# Altium schematic sheet TYPE_CO-USB3.0.SchDoc
size B
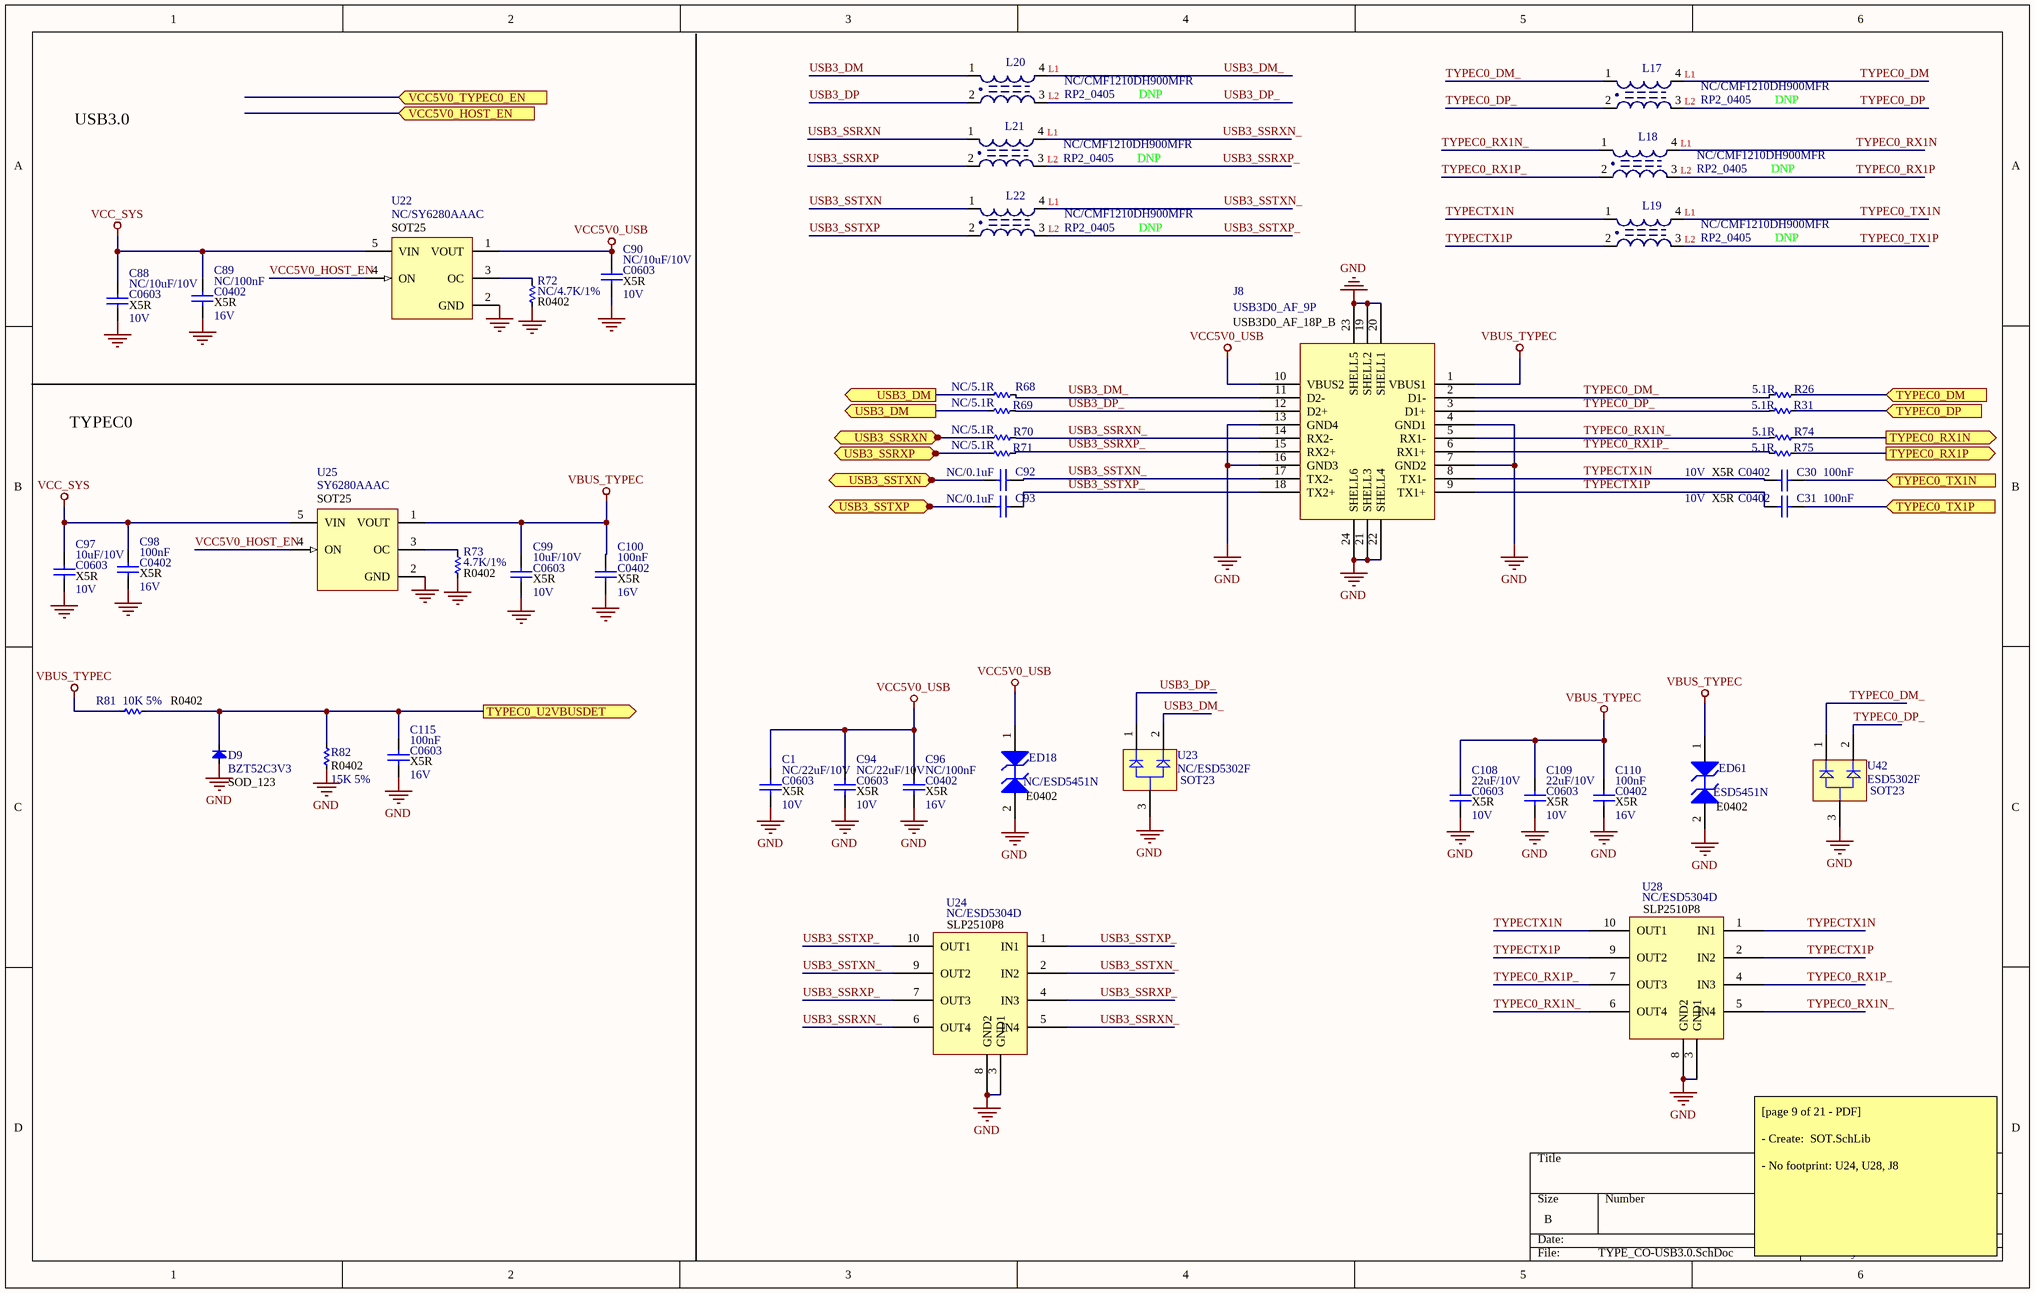
[diagram p0: TYPE_CO-USB3.0.SchDoc]

## Parts
C1  C0603  value NC/22uF/10V  [C 0603]
C30  C0402  value 100nF  [C 0402]
C31  C0402  value 100nF  [C 0402]
C88  C0603  value NC/10uF/10V  [C 0603]
C89  C0402  value NC/100nF  [C 0402]
C90  C0603  value NC/10uF/10V  [C 0603]
C92  value NC/0.1uF  [C 0402]  (hidden comment: C0402)
C93  value NC/0.1uF  [C 0402]  (hidden comment: C0402)
C94  C0603  value NC/22uF/10V  [C 0603]
C96  C0402  value NC/100nF  [C 0402]
C97  C0603  value 10uF/10V  [C 0603]
C98  C0402  value 100nF  [C 0402]
C99  C0603  value 10uF/10V  [C 0603]
C100  C0402  value 100nF  [C 0402]
C108  C0603  value 22uF/10V  [C 0603]
C109  C0603  value 22uF/10V  [C 0603]
C110  C0402  value 100nF  [C 0402]
C115  C0603  value 100nF  [C 0603]
D9  value BZT52C3V3  typr: SOD_123  [DIO-SMD-123]  (hidden comment: Diode SMD)
ED18  NC/ESD5451N  [DFN1006-2L]
ED61  ESD5451N  [DFN1006-2L]
J8  USB3D0_AF_9P  [*GCT_USB1100-XX-X_REVC]
L17  RP2_0405  [L-SMD-D-7.3x7.3]
L18  RP2_0405  [L-SMD-D-7.3x7.3]
L19  RP2_0405  [L-SMD-D-7.3x7.3]
L20  RP2_0405  [L-SMD-D-7.3x7.3]
L21  RP2_0405  [L-SMD-D-7.3x7.3]
L22  RP2_0405  [L-SMD-D-7.3x7.3]
R26  value 5.1R  [R 0402]  (hidden comment: R0402)
R31  value 5.1R  [R 0402]  (hidden comment: R0402)
R68  value NC/5.1R  [R 0402]  (hidden comment: R0402)
R69  value NC/5.1R  [R 0402]  (hidden comment: R0402)
R70  value NC/5.1R  [R 0402]  (hidden comment: R0402)
R71  value NC/5.1R  [R 0402]  (hidden comment: R0402)
R72  R0402  value NC/4.7K/1%  [R 0402]
R73  R0402  value 4.7K/1%  [R 0402]
R74  value 5.1R  [R 0402]  (hidden comment: R0402)
R75  value 5.1R  [R 0402]  (hidden comment: R0402)
R81  R0402  value 10K 5%  [R 0402]
R82  R0402  value 15K 5%  [R 0402]
U22  NC/SY6280AAAC  [DCK5_N]
U23  NC/ESD5302F  PackageReference: SOT23  [INF-SOT23_N]
U24  NC/ESD5304D  [RCLAMP0524PATCT]
U25  SY6280AAAC  [DCK5_N]
U28  NC/ESD5304D  [RCLAMP0524PATCT]
U42  ESD5302F  PackageReference: SOT23  [INF-SOT23_N]

## Ports
TYPEC0_DM (in), TYPEC0_DP (in), TYPEC0_RX1N (out), TYPEC0_RX1P (out), TYPEC0_TX1N (in), TYPEC0_TX1P (in), TYPEC0_U2VBUSDET (out), USB3_DM (out), USB3_SSRXN (out), USB3_SSRXP (out), USB3_SSTXN (out), USB3_SSTXP (out), VCC5V0_HOST_EN (in), VCC5V0_TYPEC0_EN (in)

## Nets
GND: C1.2 C88.2 C89.2 C90.2 C94.2 C96.2 C97.2 C98.2 C99.2 C100.2 C108.2 C109.2 C110.2 C115.2 D9.1(A) ED18.2(A2) ED61.2(A2) J8.4(GND1) J8.7(GND2) J8.13(GND4) J8.16(GND3) J8.19(SHELL2) J8.20(SHELL1) J8.21(SHELL3) J8.22(SHELL4) J8.23(SHELL5) J8.24(SHELL6) R72.2 R73.2 R82.1 U22.2(GND) U23.3(A) U24.3(GND1) U24.8(GND2) U25.2(GND) U28.3(GND1) U28.8(GND2) U42.3(A)
VBUS_TYPEC: C99.1 C100.1 C108.1 C109.1 C110.1 ED61.1(A1) J8.1(VBUS1) R81.1 U25.1(VOUT)
VCC5V0_USB: C1.1 C90.1 C94.1 C96.1 ED18.1(A1) J8.10(VBUS2) U22.1(VOUT)
VCC_SYS: C88.1 C89.1 C97.1 C98.1 U22.5(VIN) U25.5(VIN)
TYPEC0_DM: L17.4
TYPEC0_DM: R26.1 ; port TYPEC0_DM  [a separate net that carries the same name]
TYPEC0_DM_: J8.2(D1-) L17.1 R26.2 U42.1(K1)
TYPEC0_DP: L17.3
TYPEC0_DP: R31.1 ; port TYPEC0_DP  [a separate net that carries the same name]
TYPEC0_DP_: J8.3(D1+) L17.2 R31.2 U42.2(K2)
TYPEC0_RX1N: L18.4
TYPEC0_RX1N: R74.1 ; port TYPEC0_RX1N  [a separate net that carries the same name]
TYPEC0_RX1N_: J8.5(RX1-) L18.1 R74.2 U28.5(IN4) U28.6(OUT4)
TYPEC0_RX1P: L18.3
TYPEC0_RX1P: R75.1 ; port TYPEC0_RX1P  [a separate net that carries the same name]
TYPEC0_RX1P_: J8.6(RX1+) L18.2 R75.2 U28.4(IN3) U28.7(OUT3)
TYPEC0_TX1N: L19.4
TYPEC0_TX1N: C30.2 ; port TYPEC0_TX1N  [a separate net that carries the same name]
TYPEC0_TX1P: L19.3
TYPEC0_TX1P: C31.2 ; port TYPEC0_TX1P  [a separate net that carries the same name]
TYPEC0_U2VBUSDET: C115.1 D9.2(K) R81.2 R82.2 ; port TYPEC0_U2VBUSDET
TYPECTX1N: C30.1 J8.8(TX1-) L19.1 U28.1(IN1) U28.10(OUT1)
TYPECTX1P: C31.1 J8.9(TX1+) L19.2 U28.2(IN2) U28.9(OUT2)
USB3_DM: L20.1
USB3_DM: R68.2 R69.2 ; port USB3_DM  [a separate net that carries the same name]
USB3_DM_: J8.11(D2-) L20.4 R68.1 U23.2(K2)
USB3_DP: L20.2
USB3_DP_: J8.12(D2+) L20.3 R69.1 U23.1(K1)
USB3_SSRXN: L21.1
USB3_SSRXN: R70.2 ; port USB3_SSRXN  [a separate net that carries the same name]
USB3_SSRXN_: J8.14(RX2-) L21.4 R70.1 U24.5(IN4) U24.6(OUT4)
USB3_SSRXP: L21.2
USB3_SSRXP: R71.2 ; port USB3_SSRXP  [a separate net that carries the same name]
USB3_SSRXP_: J8.15(RX2+) L21.3 R71.1 U24.4(IN3) U24.7(OUT3)
USB3_SSTXN: L22.1
USB3_SSTXN: C92.1 ; port USB3_SSTXN  [a separate net that carries the same name]
USB3_SSTXN_: C92.2 J8.17(TX2-) L22.4 U24.2(IN2) U24.9(OUT2)
USB3_SSTXP: L22.2
USB3_SSTXP: C93.1 ; port USB3_SSTXP  [a separate net that carries the same name]
USB3_SSTXP_: C93.2 J8.18(TX2+) L22.3 U24.1(IN1) U24.10(OUT1)
VCC5V0_HOST_EN: U22.4(ON) U25.4(ON)
NetR72_1: R72.1 U22.3(OC)
NetR73_1: R73.1 U25.3(OC)

## Notes on the sheet
- USB3.0
- TYPEC0
- [page 9 of 21 - PDF]
  - Create:  SOT.SchLib
  - No footprint: U24, U28, J8
- (in symbol 1SMB54CAT3) E0402
- (in symbol Cap) X5R; 16V; 10V
- (in symbol L-SMD-2) L1; NC/CMF1210DH900MFR; L2; DNP
- (in symbol TPS22943DCKR) SOT25

## Library data of the parts
C1 C30 C31 C88-C90 C92-C94 C96-C100 C108-C110 C115 = Cap: Capacitor; Published: 8-Jun-2000; LatestRevisionDate: 17-Jul-2002; LatestRevisionNote: Re-released for DXP Platform.; PackageReference: RAD-0.3; Publisher: Altium Limited; PackageDescription: Radial Cap, Thru-Hole; 2 Leads; 0.3 in Pin Spacing
D9 = Diode SMD: Default Diode; Code - JEDEC: DO-214-AB; Published: 8-Jun-2000; Revision: July-2002: Re-released for DXP Platform.; Publisher: Altium Limited
ED18 ED61 = 1SMB54CAT3: 600 W Peak Power Zener Transient Voltage Suppressor, Bidirectional, 2-Pin SMB, Tape and Reel; Manufacturer: On Semiconductor; IR Max (uA): 5; PPK Max (W): 600; V(BR) Typ (V): 63.16; DatasheetVersion: Rev. A; PackageVersion: Rev. A, 01/2000; PackageReference: SMB-2-403C-01; PackageDescription: 2-Pin Small Molded Package, J-Bend Lead, Body 4.315 x 3.555 mm; Supplier 1: Digi-Key; Supplier Part Number 1: 1SMB54CAT3-ND; Direction: Bidirectional; Packing: Tape and Reel; Mounting Technology: Surface Mount; PartNumber: 1SMB54CAT3; ComponentLink1Description: Manufacturer URL; ComponentLink1URL: http://www.onsemi.com/; ComponentLink2Description: Datasheet; ComponentLink2URL: http://www.onsemi.com/pub_link/Collateral/1SMB10CAT3-D.PDF; ComponentLink3Description: Package Specification; ComponentLink3URL: http://www.onsemi.com/pub_link/Collateral/1SMB10CAT3-D.PDF
J8 = USB3D0_AF_18P_B
L17-L22 = L-SMD-2: partNo: 7448709022; Manufacturer: Würth Elektronik eiSos GmbH; Inductance: 2.20 µH; ComponentLink1Description: Manufacturer; ComponentLink1URL: http://www.we-online.de; Created by: Christin Otto; Created Date: August 2013; ComponentLink2Description: Datasheet; ComponentLink2URL: http://katalog.we-online.de/pbs/datasheet/7448709022.pdf
R26 R31 R68-R75 R81 R82 = Res-SMD: Resistor; Manufacturer: Generic Components; Class: Passive; Published: 08/06/2000; Publisher: Altium Hobart Technology Centre
U22 U25 = TPS22943DCKR: Low-Input Voltage 40 mA Current Limited Load Switch, 400 mOhms rDS(On), -40 to 85 degC, 5-pin SC70 (DCK), Green (RoHS & no Sb/Br); Manufacturer: Texas Instruments; Adjustable Current Limit(Min)(A): 0.04; Enable/Shutdown: Active High; Iq(Typ)(uA): 40; Number of FETs: 1; rDS(on) per FET(Typ)(mOhms): 400; SubFamily: Current Limited Switch; Vin(Max)(V): 5.5; Vin(Min)(V): 1.62; DatasheetVersion: SLVS832C; PackageVersion: revG, Jan-2007; PackageReference: DCK5; PackageDescription: 5-Pin Plastic Small-Outline Package, 2 x 1.3 mm Body, 0.65 mm Pitch, 2.1 mm Lead Span; Supplier 1: Digi-Key; Supplier Part Number 1: 296-25316-2-ND; Supplier 2: Digi-Key; Supplier Part Number 2: 296-25316-1-ND; Supplier 3: Digi-Key; Supplier Part Number 3: 296-25316-6-ND; Supplier 4: Farnell; Supplier Part Number 4: 1782839; Supplier 5: Newark; Supplier Part Number 5: 51R1165; Supplier 6: Mouser; Supplier Part Number 6: 595-TPS22943DCKR; Eco-Plan: Green (RoHS & no Sb/Br); Mounting Technology: Surface Mount; Code_JEDEC: MO-203-AA; PartNumber: TPS22943DCKR; ComponentLink1Description: Datasheet; ComponentLink1URL: http://www.ti.com/general/docs/lit/getliterature.tsp?genericPartNumber=TPS22943&fileType=pdf
U23 U42 = BAS70-06: Silicon Schottky Diode, -55 to 125 degC, SOT23, Reel, Green; Manufacturer: Infineon; Configuration: Dual; CT (max): 2 pF; Green: TRUE; IF (max): 70 mA; VF (max): 1,000 mV; VR (max): 70 V; PackageVersion: Apr-08; PackageDescription: 3-Pin Small Outline Transistor Package, 1.3 x 2.9 mm Body, 0.95 mm Pitch; Packing: Reel; Mounting Technology: Surface Mount; PartNumber: BAS70-06; ComponentLink1Description: Manufacturer URL; ComponentLink1URL: http://www.infineon.com/; ComponentLink2Description: Datasheet; ComponentLink2URL: http://www.infineon.com/dgdl/bas70_bas170series.pdf?folderId=db3a30431400ef68011425f1ca2505e3&fileId=db3a304314dca389011518ad41680e12; ComponentLink3Description: Package Specification; ComponentLink3URL: http://www.infineon.com/dgdl/SOT23-Package_Overview.pdf?folderId=db3a30431936bc4b0119532290053c66&fileId=db3a30431936bc4b0119533468123c85
U24 U28 = SLP2510P8